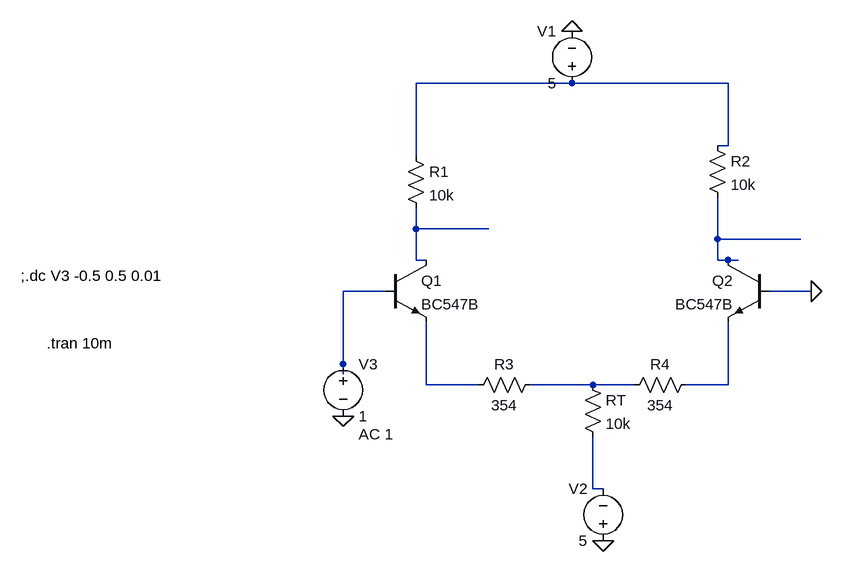
[diagram p0: schematic pregain.asc]
pregain.asc, the LTspice schematic file:
Version 4
SHEET 1 1092 680
WIRE 512 -128 272 -128
WIRE 752 -128 512 -128
WIRE 752 -32 752 -128
WIRE 752 -32 736 -32
WIRE 272 -16 272 -128
WIRE 272 96 272 64
WIRE 384 96 272 96
WIRE 736 112 736 48
WIRE 864 112 736 112
WIRE 272 144 272 96
WIRE 288 144 272 144
WIRE 736 144 736 112
WIRE 752 144 736 144
WIRE 768 144 752 144
WIRE 224 192 160 192
WIRE 880 192 816 192
WIRE 160 304 160 192
WIRE 160 320 160 304
WIRE 288 336 288 240
WIRE 368 336 288 336
WIRE 544 336 448 336
WIRE 608 336 544 336
WIRE 752 336 752 240
WIRE 752 336 688 336
WIRE 544 496 544 416
WIRE 560 496 544 496
FLAG 512 -208 0
FLAG 560 576 0
FLAG 880 192 0
FLAG 160 384 0
SYMBOL npn 224 144 R0
SYMATTR InstName Q1
SYMATTR Value BC547B
SYMBOL npn 816 144 M0
SYMATTR InstName Q2
SYMATTR Value BC547B
SYMBOL voltage 512 -112 R180
WINDOW 0 24 96 Left 2
WINDOW 3 24 16 Left 2
WINDOW 123 0 0 Left 0
WINDOW 39 0 0 Left 0
SYMATTR InstName V1
SYMATTR Value 5
SYMBOL voltage 560 592 R180
WINDOW 0 24 96 Left 2
WINDOW 3 24 16 Left 2
WINDOW 123 0 0 Left 0
WINDOW 39 0 0 Left 0
SYMATTR InstName V2
SYMATTR Value 5
SYMBOL res 720 -48 R0
SYMATTR InstName R2
SYMATTR Value 10k
SYMBOL res 528 320 R0
SYMATTR InstName RT
SYMATTR Value 10k
SYMBOL res 464 320 R90
WINDOW 0 0 56 VBottom 2
WINDOW 3 32 56 VTop 2
SYMATTR InstName R3
SYMATTR Value 354
SYMBOL res 704 320 R90
WINDOW 0 0 56 VBottom 2
WINDOW 3 32 56 VTop 2
SYMATTR InstName R4
SYMATTR Value 354
SYMBOL res 256 -32 R0
SYMATTR InstName R1
SYMATTR Value 10k
SYMBOL voltage 160 288 R0
WINDOW 123 24 124 Left 2
WINDOW 39 0 0 Left 0
SYMATTR InstName V3
SYMATTR Value 1
SYMATTR Value2 AC 1
TEXT -336 168 Left 2 !;.dc V3 -0.5 0.5 0.01
TEXT -296 272 Left 2 !.tran 10m

The netlist it stands for:
* pregain.asc
Q1 N002 N004 N005 0 BC547B
Q2 N003 0 N007 0 BC547B
V1 N001 0 5
V2 0 N008 5
R2 N001 N003 10k
RT N006 N008 10k
R3 N006 N005 354
R4 N007 N006 354
R1 N001 N002 10k
V3 N004 0 1 AC 1
.model NPN NPN
.model PNP PNP
.lib standard.bjt
;.dc V3 -0.5 0.5 0.01
.tran 10m
.backanno
.end